# EasyEDA Pro project E-SportsV0.2-2.epro, board PCB2_1
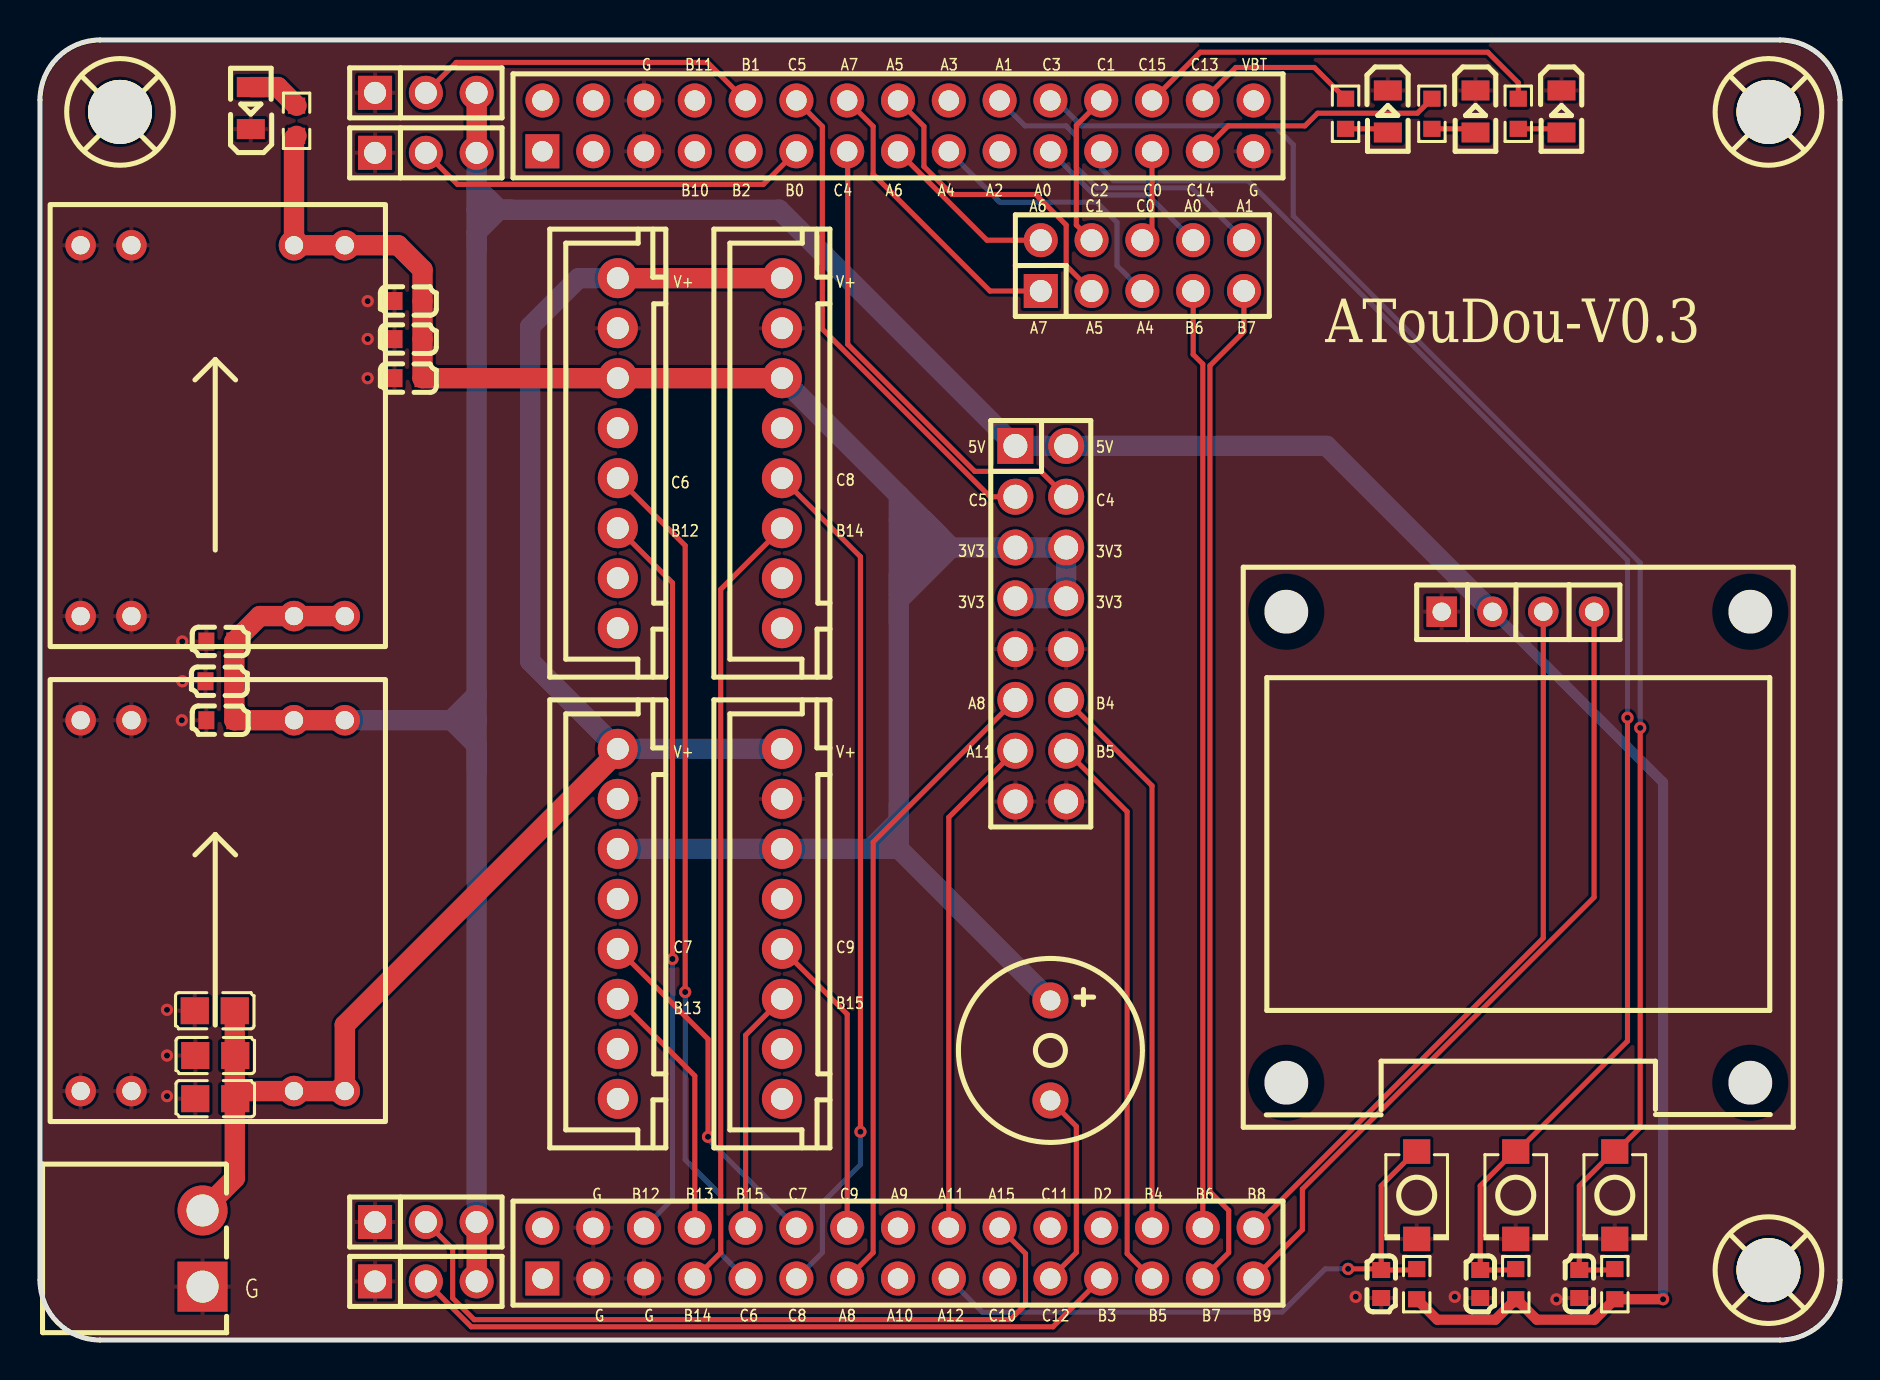
[diagram p7: board, top side]
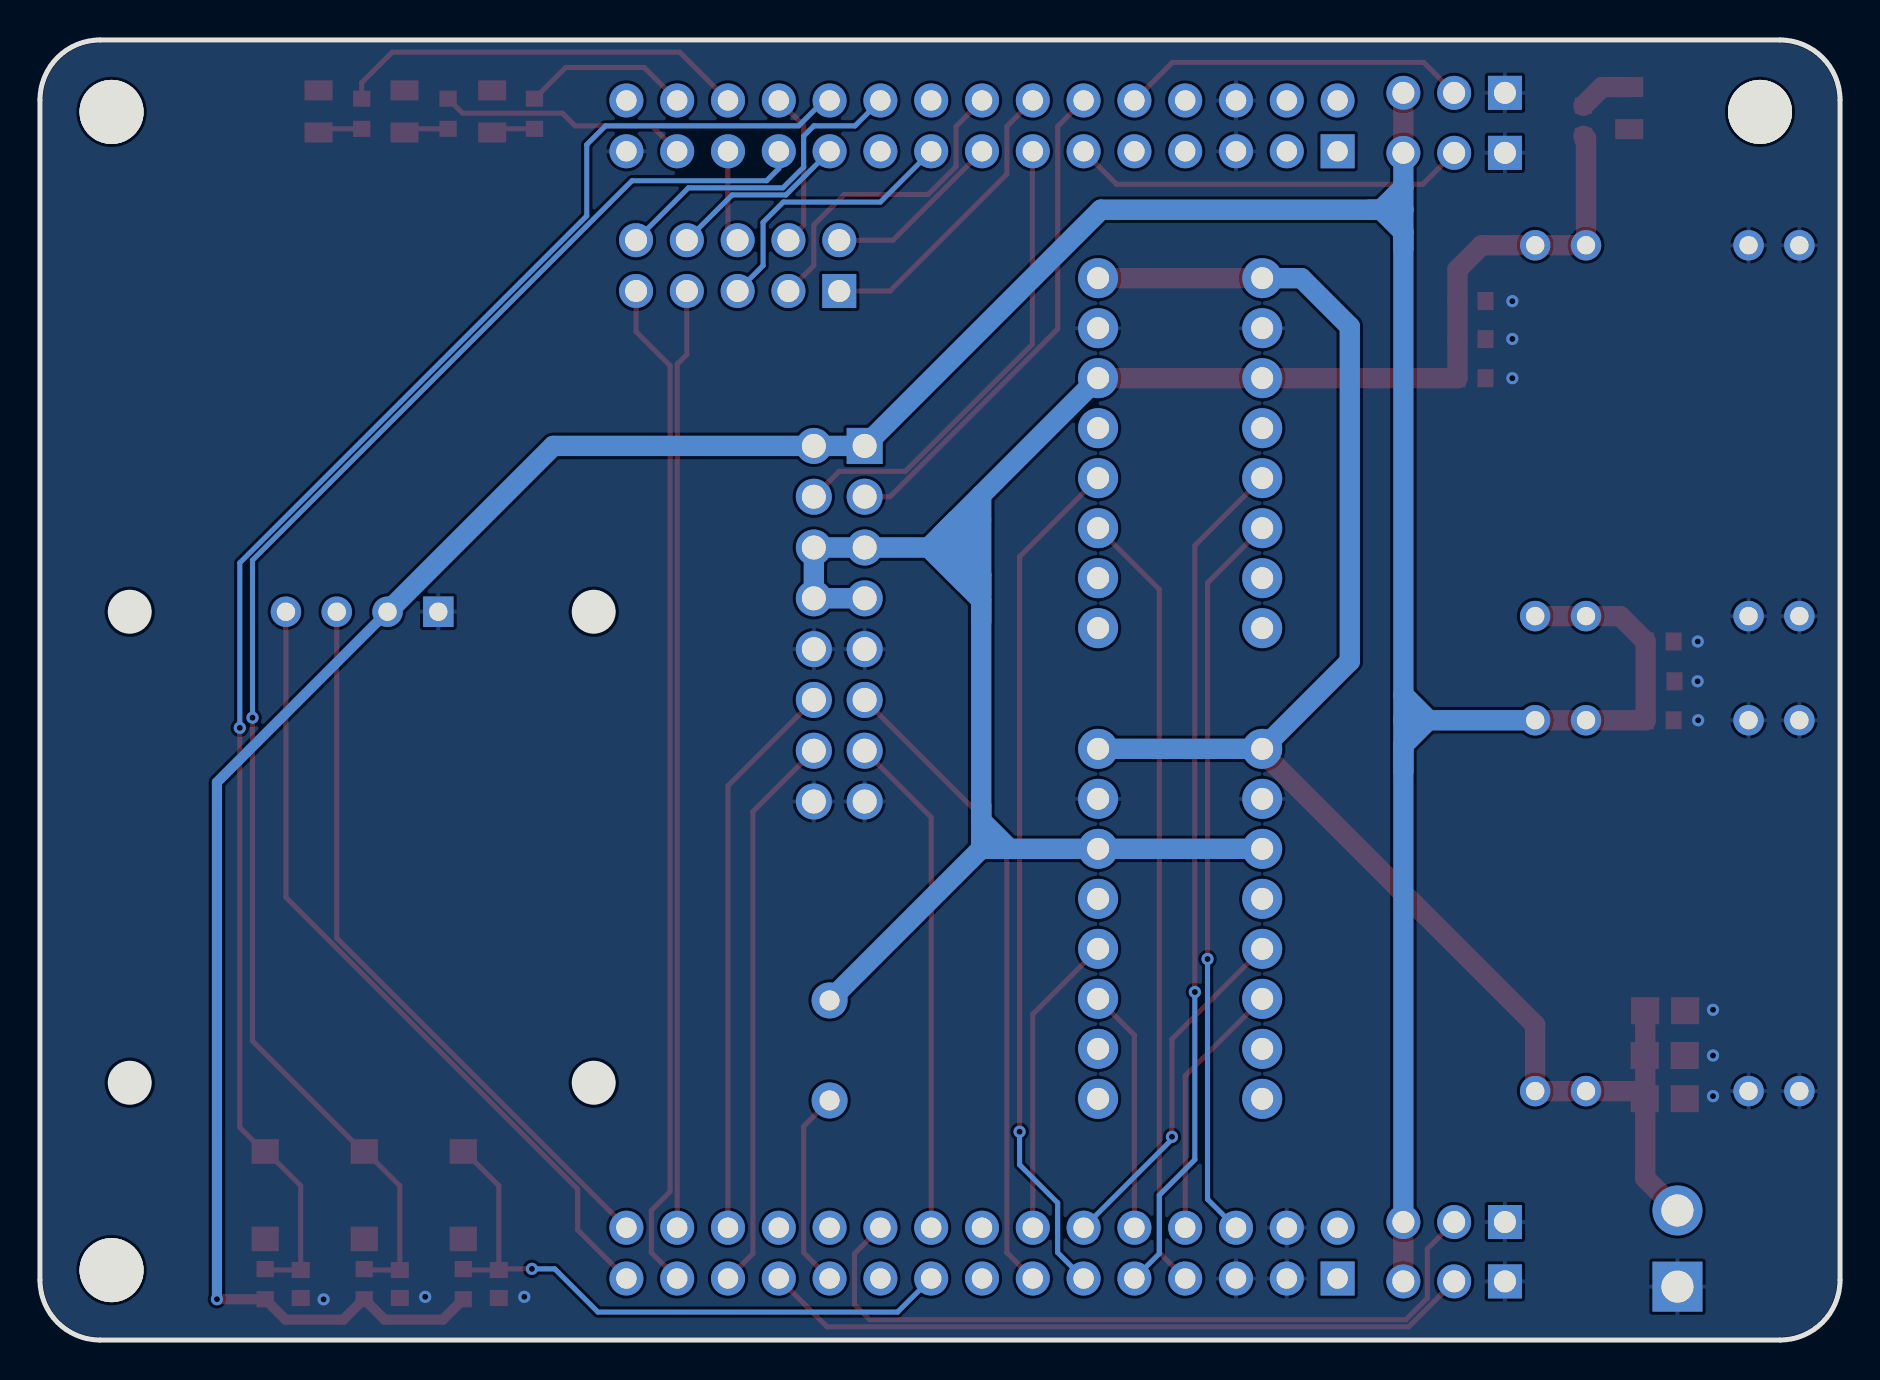
[diagram p8: board, bottom side, seen from below]

Outline 90 x 65 mm; copper layers: Top Layer, Bottom Layer. Coordinates in mm from the lower left corner of the outline.
Outline path: 0,62 0,3 arc(0.88,0.88) 3,0 87,0 arc(89.12,0.88) 90,3 90,62 arc(89.12,64.12) 87,65 3,65 arc(0.88,64.12) 0,62
Stack: Top Layer 0.035mm / Dielectric1 1.51mm FR4 er 4.5 / Bottom Layer 0.035mm

## Design rules (mm)
template: JLCPCB Capability(Two Layers Board)
spacing copperThickness1oz (default): track to track 0.102, other pairs 0.152 to 0.3
spacing copperThickness2oz: track to track 0.203, other pairs 0.152 to 0.3
track width copperThickness1oz (default): min 0.127, default 0.254, max 2.54
track width copperThickness2oz: min 0.203, default 0.254, max 2.54
differential pair differentialPair (default): width min 0.127, default 0.254, max 2.54; gap min 0.152, default 0.152
via viaSize (default): diameter min 0.5, default 0.61, max 10; hole min 0.3, default 0.305, max 6.3

## Placement (name value [footprint] x y rotation side)
BUZZER1  3kHz  [BUZ-TH_BD9.0-P5.00-D0.6-FD]  50.52 14.48 270 top
C13  10uF  [C0805]  8.76 12.06 0 top
C14  10uF  [C0805]  8.76 14.22 0 top
C15  10uF  [C0805]  8.74 16.46 0 top
C16  100nF  [C0603]  18.43 50.04 0 top
C17  100nF  [C0603]  18.43 51.95 0 top
C18  100nF  [C0603]  18.43 48.09 0 top
C19  100nF  [C0603]  9.02 34.92 0 top
C20  100nF  [C0603]  8.98 32.94 0 top
C21  100nF  [C0603]  9.02 30.99 0 top
C27  100nF  [C0603]  72.01 2.8 270 top
C28  100nF  [C0603]  76.96 2.8 270 top
C29  100nF  [C0603]  67.06 2.8 270 top
CN4  DB2ERC-3.81-2P-GN  [CONN-TH_2P-P3.81_DB2ERC-3.81-2P]  8.13 4.57 270 top
CN5  ZX-XH2.54-8PZZ  [CONN-TH_8P-P2.50-XH2.54-8P]  28.89 44.34 270 top
CN6  ZX-XH2.54-8PZZ  [CONN-TH_8P-P2.50-XH2.54-8P]  28.89 20.81 270 top
CN7  ZX-XH2.54-8PZZ  [CONN-TH_8P-P2.50-XH2.54-8P]  37.09 44.34 270 top
CN8  ZX-XH2.54-8PZZ  [CONN-TH_8P-P2.50-XH2.54-8P]  37.09 20.81 270 top
H1  PZ254V-11-03P  [HDR-TH_3P-P2.54-V-M]  19.29 62.36 0 top
H2  PZ254V-11-03P  [HDR-TH_3P-P2.54-V-M]  19.29 59.36 0 top
H3  PZ254V-11-03P  [HDR-TH_3P-P2.54-V-M]  19.29 2.93 0 top
H4  PZ254V-11-03P  [HDR-TH_3P-P2.54-V-M]  19.29 5.9 0 top
H5  PZ254V-12-10P  [HDR-TH_10P-P2.54-V-M-R2-C5-S2.54]  55.12 53.72 0 top
H6  PZ254V-12-16P  [HDR-TH_16P-P2.54-V-M-R2-C8-S2.54]  50.04 35.81 270 top
LED1  KT-0805W  [LED0805-R-RD]  10.54 61.59 90 top
LED2  KT-0805白灯  [LED0805-R-RD]  71.78 61.43 270 top
LED3  KT-0805白灯  [LED0805-R-RD]  76.07 61.43 270 top
LED4  KT-0805白灯  [LED0805-R-RD]  67.39 61.43 270 top
OLED1  0.96OLED_4P_MODULE_JX  [0.96OLED_4P]  73.91 24.64 0 top
R1  1K  [R0603]  65.28 61.31 270 top
R2  1K  [R0603]  69.6 61.31 270 top
R3  1K  [R0603]  73.91 61.31 270 top
R4  1K  [R0603]  12.83 60.96 90 top
R5  10K  [R0603]  73.79 2.79 90 top
R6  10K  [R0603]  78.74 2.79 90 top
R7  10K  [R0603]  68.84 2.79 90 top
SCREW1  -  [M3螺丝]  4.06 61.34 0 top
SCREW2  -  [M3螺丝]  86.49 61.34 0 top
SCREW3  -  [M3螺丝]  86.49 3.43 0 top
SW1  TS-1088-AR02016  [SW-SMD_L3.9-W3.0-P4.45]  73.79 7.24 270 top
SW2  TS-1088-AR02016  [SW-SMD_L3.9-W3.0-P4.45]  78.74 7.24 270 top
SW3  TS-1088-AR02016  [SW-SMD_L3.9-W3.0-P4.45]  68.83 7.24 270 top
U8  PM254-2-15-Z-8.5  [HDR-TH_30P-P2.54-V-F-R2-C15-S2.54-2]  42.9 4.34 0 top
U9  PM254-2-15-Z-8.5  [HDR-TH_30P-P2.54-V-F-R2-C15-S2.54-2]  42.9 60.71 0 top
U11  -  [MP1584模块]  2.03 12.45 90 top
U12  -  [MP1584模块]  2.03 36.19 90 top

## Footprints (pads in the part's own frame, mm; a bottom-side part is the same pattern mirrored in y, then rotated)
0.96OLED_4P
  rect 1.524x1.524 hole 0.914: 1(-3.83,11.775)
  round 1.524 hole 0.914: 2(-1.29,11.775) 3(1.25,11.775) 4(3.789,11.775)
BUZ-TH_BD9.0-P5.00-D0.6-FD
  round 1.8 hole 1: 1(-2.5,0) 2(2.5,0)
C0603
  rect 0.8x0.9 smd: 1(-0.7,0) 2(0.7,0)
C0805
  rect 1.41x1.35 smd: 1(-1,0) 2(1,0)
CONN-TH_2P-P3.81_DB2ERC-3.81-2P
  rect 2.5x2.5 hole 1.6: 1(1.905,0)
  round 2.5 hole 1.6: 2(-1.905,0)
CONN-TH_8P-P2.50-XH2.54-8P
  round 2 hole 1.1: 1(8.75,0) 2(6.25,0) 3(3.75,0) 4(1.25,0) 5(-1.25,0) 6(-3.75,0) 7(-6.25,0) 8(-8.75,0)
HDR-TH_3P-P2.54-V-M
  rect 1.7x1.7 hole 1.1: 1(-2.54,0)
  round 1.7 hole 1.1: 2(0,0) 3(2.54,0)
HDR-TH_10P-P2.54-V-M-R2-C5-S2.54
  rect 1.7x1.7 hole 1.1: 1(-5.08,-1.27)
  round 1.7 hole 1.1: 2(-5.08,1.27) 3(-2.54,-1.27) 4(-2.54,1.27) 5(0,-1.27) 6(0,1.27) 7(2.54,-1.27) 8(2.54,1.27) 9(5.08,-1.27) 10(5.08,1.27)
HDR-TH_16P-P2.54-V-M-R2-C8-S2.54
  rect 1.8x1.8 hole 1.2: 1(-8.89,-1.27)
  round 1.8 hole 1.2: 2(-8.89,1.27) 3(-6.35,-1.27) 4(-6.35,1.27) 5(-3.81,-1.27) 6(-3.81,1.27) 7(-1.27,-1.27) 8(-1.27,1.27) 9(1.27,-1.27) 10(1.27,1.27) 11(3.81,-1.27) 12(3.81,1.27) 13(6.35,-1.27) 14(6.35,1.27) 15(8.89,-1.27) 16(8.89,1.27)
HDR-TH_30P-P2.54-V-F-R2-C15-S2.54-2
  rect 1.7x1.7 hole 1.02: 1(-17.78,-1.27)
  round 1.7 hole 1.02: 2(-17.78,1.27) 3(-15.24,-1.27) 4(-15.24,1.27) 5(-12.7,-1.27) 6(-12.7,1.27) 7(-10.16,-1.27) 8(-10.16,1.27) 9(-7.62,-1.27) 10(-7.62,1.27) 11(-5.08,-1.27) 12(-5.08,1.27) 13(-2.54,-1.27) 14(-2.54,1.27) 15(0,-1.27) 16(0,1.27) 17(2.54,-1.27) 18(2.54,1.27) 19(5.08,-1.27) 20(5.08,1.27) 21(7.62,-1.27) 22(7.62,1.27) 23(10.16,-1.27) 24(10.16,1.27) 25(12.7,-1.27) 26(12.7,1.27) 27(15.24,-1.27) 28(15.24,1.27) 29(17.78,-1.27) 30(17.78,1.27)
LED0805-R-RD
  rect 1x1.399 smd: 1(1.05,0) 2(-1.05,0)
M3螺丝
  round 3.2 hole 3.2: 1(-0.064,0.064)
MP1584模块
  round 1.524 hole 0.914: 1(0,0) 2(0,-2.54) 3(0,-10.668) 4(0,-13.208) 5(18.542,-13.208) 6(18.542,-10.668) 7(18.542,-2.54) 8(18.542,0)
R0603
  rect 0.806x0.864 smd: 1(-0.753,0) 2(0.753,0)
SW-SMD_L3.9-W3.0-P4.45
  rect 1.23x1.36 smd: 1(-2.185,0) 2(2.185,0)

## Nets
As in the schematic.

Pads without a net: CN5 1 2 5; CN6 1 2 5; CN7 1 2 5; CN8 1 2 5; SCREW1 1; SCREW2 1; SCREW3 1; U8 1 2; U9 1 2 3 4

## Via types
v1: diameter 0.61, hole 0.305, Top Layer to Bottom Layer, 20 vias

## Routing (per net, layer and track width the routed paths; a pad name or vN(x,y) marks a point on that pad's centre or on a via; arc(x,y) is an arc through that point)
3V3: length 118.6
  Top Layer w1.016: R4.1 12.7,60.08 U12.6 U12.5 17.91,54.74 19.13,53.52 C17.2 C16.2 C18.2 CN5.6 CN7.6
  Bottom Layer w1.016: 41.53,24.56 42.94,25.97 42.94,26.76 ; 42.94,37.23 42.94,38.27 44.3,39.62 ; 42.94,35.88 42.94,37 45.56,39.62 ; 42.94,41 44.19,41 44.92,40.27 43.68,40.27 43.04,39.62 45.56,39.62 ; 45.56,39.62 H6.5 H6.6 H6.8 H6.7 ; 45.56,39.62 42.94,42.25 ; 42.94,24.56 42.94,42.25 ; 42.94,24.56 CN8.6 CN6.6 ; 42.94,24.56 BUZZER1.1 ; 42.94,42.25 CN7.6
5V: length 202
  Top Layer w0.508: R7.1 69.86,1.02 72.77,1.02 R5.1 73.82,2.04 74.84,1.02 77.72,1.02 R6.1 v1(81.15,2.04)
  Top Layer w1.016: U12.4 U12.3 10.99,36.19 C19.2 C21.2 U11.6 U11.5 ; H4.3 H3.3 ; H1.3 H2.3
  Bottom Layer w0.508: 72.62,36.41 81.15,27.88 v1(81.15,2.04)
  Bottom Layer w1.016: 20.56,30.99 21.83,32.26 ; 20.58,30.99 21.83,29.74 21.83,28.46 ; 21.83,57.63 22.95,56.52 ; 22.95,56.52 21.83,55.4 21.83,54.6 ; 22.95,56.52 23.55,56.52 ; 21.83,56.52 H2.3 ; 21.83,56.52 21.83,30.99 ; 21.83,56.52 36.96,56.52 H6.1 H6.2 64.33,44.7 72.62,36.41 ; 21.83,30.99 U11.5 ; 21.83,30.99 H4.3
12V: length 83.8
  Top Layer w1.016: CN4.2 9.74,8.09 C15.2 ; CN5.8 CN7.8 ; C13.2 10.14,12.45 U11.3 U11.4 15.24,15.75 28.89,29.4 CN6.8
  Bottom Layer w1.016: CN8.8 CN6.8 24.51,33.94 24.51,50.67 26.93,53.09 CN5.8
GND:
  vias: v1(6.35,16.51) v1(6.35,14.22) v1(6.35,12.19) v1(7.11,34.92) v1(7.12,32.94) v1(7.09,30.99) v1(16.38,51.94) v1(16.38,50.05) v1(16.38,48.09) v1(65.79,2.16) v1(70.74,2.16) v1(75.82,2.03)
PA0: length 9
  Bottom Layer w0.254: H5.8 55.4,57.25 52.7,57.25 U9.21
PA1: length 16
  Bottom Layer w0.254: H5.10 57.58,57.61 52.85,57.61 51.82,58.64 51.82,60.2 51.31,60.71 49.25,60.71 U9.20
PA4: length 13.8
  Bottom Layer w0.254: U9.17 47.98,56.9 52.83,56.9 53.85,55.88 53.85,53.72 H5.5
PA5: length 16
  Top Layer w0.254: U9.16 44.2,60.68 44.2,58.67 45.59,57.28 49.78,57.28 51.31,55.75 51.31,53.72 H5.3
PA6: length 9
  Top Layer w0.254: H5.2 47.35,54.99 U9.15
PA7: length 15
  Top Layer w0.254: H5.1 47.5,52.45 41.66,58.29 41.66,60.68 U9.14
PA8: length 32.4
  Top Layer w0.254: H6.11 41.66,24.89 41.66,4.37 U8.13
PA11: length 25.2
  Top Layer w0.254: U8.18 45.44,26.14 H6.13
PA12: length 31.7
  Top Layer w0.254: v1(65.41,3.56) 67,3.56 C29.1 ; SW3.1 68.77,9.42 67.06,7.71 C29.1 ; C29.1 68.79,3.5 68.84,3.54
  Bottom Layer w0.254: v1(65.41,3.56) 64.26,3.56 62.1,1.4 47.12,1.4 U8.17
PA15: length 38.1
  Top Layer w0.254: U8.20 49.28,4.32 49.28,1.78 48.51,1.02 21.71,1.02 20.63,2.09 20.63,4.56 H4.2
PB0: length 19.9
  Top Layer w0.254: H2.2 20.87,57.78 36.17,57.78 U9.11
PB1: length 17.4
  Top Layer w0.254: H1.2 20.82,63.88 33.38,63.88 U9.10
PB3: length 35.7
  Top Layer w0.254: H3.2 21.56,0.66 50.65,0.66 U8.23
PB4: length 28.2
  Top Layer w0.254: U8.26 55.6,27.71 H6.12
PB5: length 28.2
  Top Layer w0.254: H6.14 54.36,26.42 54.36,4.32 U8.25
PB6: length 47
  Top Layer w0.254: H5.7 57.66,49.28 58.14,48.79 U8.28
PB7: length 51
  Top Layer w0.254: U8.27 59.44,4.37 59.44,6.48 58.5,7.42 58.5,48.72 60.2,50.42 H5.9
PB8: length 36.8
  Top Layer w0.254: U8.30 75.16,20.1 75.16,36.41
PB9: length 40.4
  Top Layer w0.254: 77.7,36.41 77.7,22.13 63.12,7.55 63.12,5.51 U8.29
PB12: length 36.7
  Top Layer w0.254: v1(31.62,19.05) 31.62,37.86 CN5.3
  Bottom Layer w0.254: v1(31.62,19.05) 31.62,7.04 U8.6
PB13: length 13
  Top Layer w0.254: CN6.3 32.74,13.21 U8.8
PB14: length 39.3
  Top Layer w0.254: U8.7 34.04,4.37 34.04,37.53 CN7.3
PB15: length 12.2
  Top Layer w0.254: U8.10 35.28,15.24 CN8.3
PC0: length 4.6
  Top Layer w0.254: U9.25 55.6,55.47 H5.6
PC1: length 7.8
  Top Layer w0.254: U9.24 51.82,60.73 51.82,55.75 H5.4
PC2: length 75.7
  Top Layer w0.254: v1(79.38,31.11) 79.38,14.95 73.85,9.42 SW1.1 73.72,9.42 72.01,7.71 C27.1 73.74,3.5 73.79,3.54
  Bottom Layer w0.254: v1(79.38,31.11) 79.38,38.99 60.4,57.96 53.67,57.96 53.06,58.57 U9.23
PC3: length 79.4
  Top Layer w0.254: 78.74,3.54 78.7,3.5 C28.1 76.96,7.71 78.68,9.42 SW2.1 78.81,9.42 80.01,10.63 v1(80.01,30.61)
  Bottom Layer w0.254: U9.22 50.8,61.98 52.07,60.71 61.72,60.71 62.66,59.76 62.66,56.2 80.01,38.86 80.01,30.84
PC4: length 23.7
  Top Layer w0.254: H6.4 50.04,43.43 46.74,43.43 40.39,49.78 40.39,59.41 U9.13
PC5: length 25.1
  Top Layer w0.254: H6.3 47.5,42.16 39.12,50.55 39.12,60.68 U9.12
PC6: length 42.7
  Top Layer w0.254: CN5.4 32.26,39.72 v1(32.26,17.4)
  Bottom Layer w0.254: U8.9 34.04,4.32 34.04,7.24 32.26,9.02 v1(32.26,17.4)
PC7: length 17.6
  Top Layer w0.254: v1(33.4,10.16) 33.4,15.05 CN6.4
  Bottom Layer w0.254: v1(33.4,10.16) 33.4,10.03 U8.12
PC8: length 43
  Top Layer w0.254: v1(41.02,10.41) 41.02,39.17 CN7.4
  Bottom Layer w0.254: U8.11 39.12,4.37 39.12,6.86 41.02,8.76 v1(41.02,10.41)
PC9: length 15.3
  Top Layer w0.254: CN8.4 40.36,16.29 U8.14
PC12: length 10
  Top Layer w0.254: BUZZER1.2 51.82,10.68 51.82,4.37 U8.21
PC13: length 8.5
  Top Layer w0.254: U9.28 59.79,63.63 63.72,63.63 R1.1
PC14: length 12.5
  Top Layer w0.254: U9.27 59.41,60.71 63.25,60.71 63.88,61.34 68.87,61.34 R2.1
PC15: length 20.7
  Top Layer w0.254: U9.26 58.01,64.39 72.39,64.39 73.91,62.86 R3.1
$1N6555: length 2.7
  Top Layer w1.016: LED1.1 11.89,62.65 R4.2
$1N8963: length 2.2
  Top Layer w0.254: 67.39,60.38 67.21,60.56 65.28,60.56
$1N8970: length 2.3
  Top Layer w0.254: 71.78,60.38 71.59,60.56 69.6,60.56
$1N8971: length 2.2
  Top Layer w0.254: 73.91,60.56 75.89,60.56 76.07,60.38

## Copper pours and planes (outline as drawn; the poured copper is in the pictures)
GND on Top Layer: -2.67,67.44 93.22,67.44 93.22,-1.14 -2.67,-1.14
GND on Bottom Layer: -3.81,67.94 93.85,67.94 93.85,-3.3 -3.81,-3.3

## Text on the board
Top Silkscreen Layer: G | B12 | C6 | V+ | C7 | B13 | B10 | B14 | B11 | B2 | B15 | B1 | B0 | C5 | C8 | C4 | C9 | A8 | A7 | A6 | A5 | A10 | A9 | A4 | A12 | A11 | A3 | 3V3 | 5V | A2 | A15 | C10 | A1 | A0 | C11 | C12 | C3 | C1 | C2 | D2 | B4 | B5 | B3 | C0 | C15 | B6 | C14 | C13 | B7 | VBT | B8 | B9 | ATouDou-V0.3
